# Altium schematic sheet PCB_PDB.SchDoc
size A3; SheetNumber: 1; SheetTotal: 1
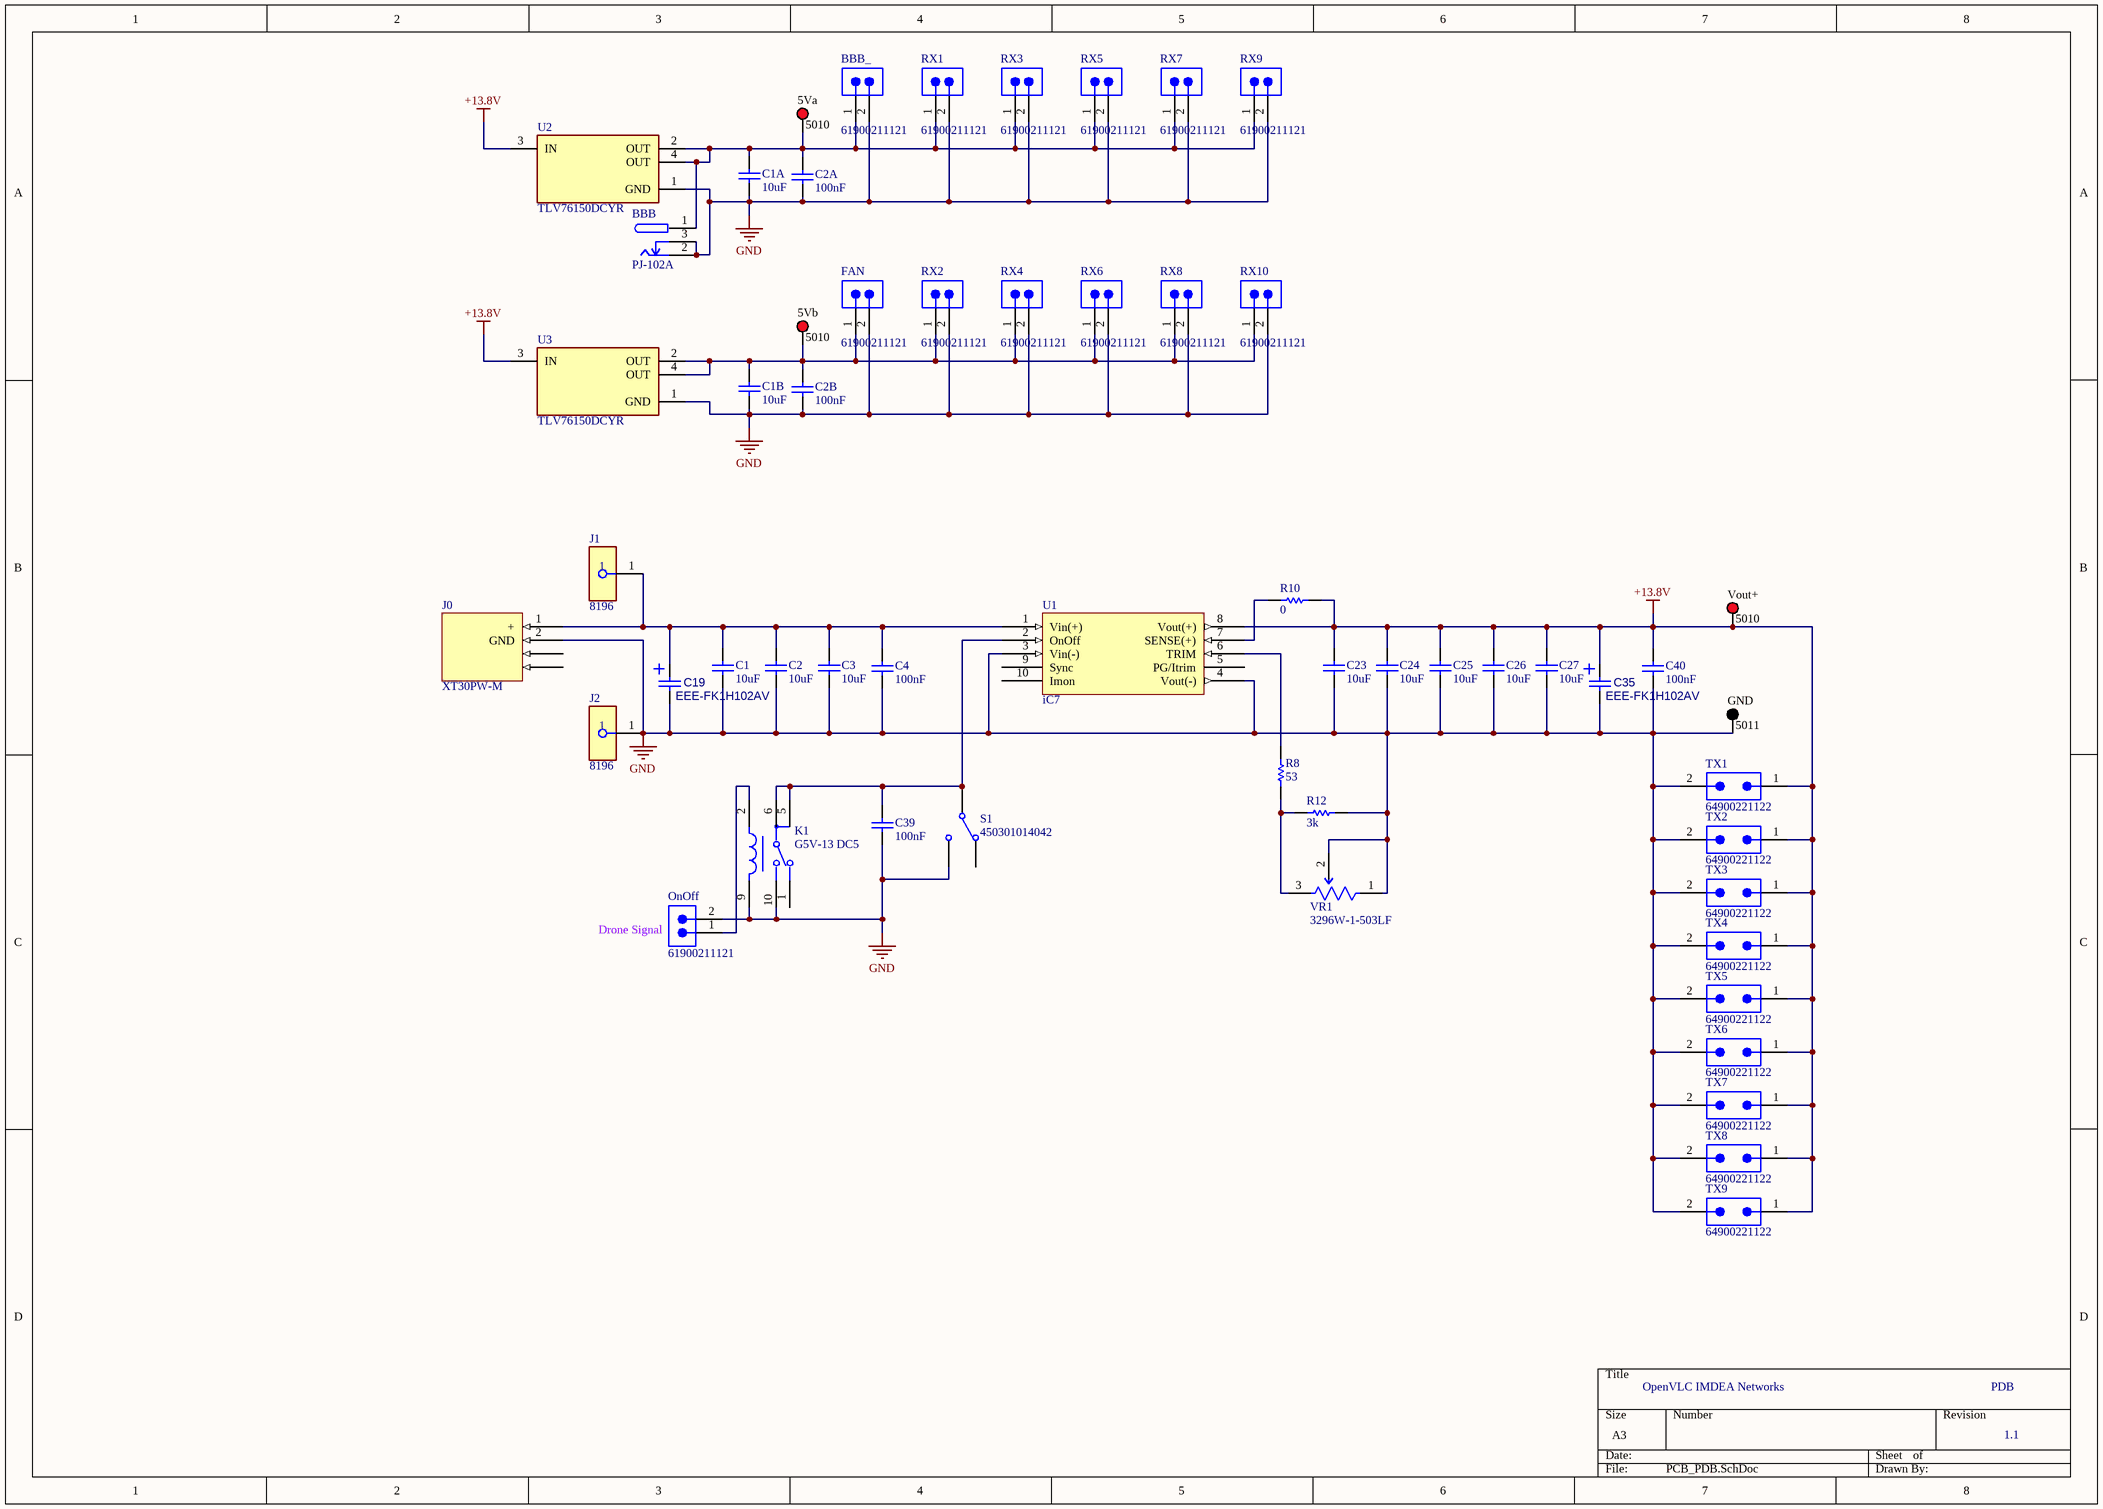
[diagram p0: PCB_PDB.SchDoc]

## Parts
5Va  5010  [KSTN-5010_V]
5Vb  5010  [KSTN-5010_V]
BBB  PJ-102A  [FP-PJ-102A-MFG]
BBB_  61900211121  [61900211121]
C1  value 10uF  [RESC1608X55N]  (hidden comment: GRM188R6YA106MA73D)
C1A  value 10uF  [RESC1608X55N]  (hidden comment: GRM188R6YA106MA73D)
C1B  value 10uF  [RESC1608X55N]  (hidden comment: GRM188R6YA106MA73D)
C2  value 10uF  [RESC1608X55N]  (hidden comment: GRM188R6YA106MA73D)
C2A  value 100nF  [RESC1608X55N]  (hidden comment: GCM188R71H104KA57J)
C2B  value 100nF  [RESC1608X55N]  (hidden comment: GCM188R71H104KA57J)
C3  value 10uF  [RESC1608X55N]  (hidden comment: GRM188R6YA106MA73D)
C4  value 100nF  [RESC1608X55N]  (hidden comment: GCM188R71H104KA57J)
C19  EEE-FK1H102AV  [CAP-17x17]
C23  value 10uF  [RESC1608X55N]  (hidden comment: GRM188R6YA106MA73D)
C24  value 10uF  [RESC1608X55N]  (hidden comment: GRM188R6YA106MA73D)
C25  value 10uF  [RESC1608X55N]  (hidden comment: GRM188R6YA106MA73D)
C26  value 10uF  [RESC1608X55N]  (hidden comment: GRM188R6YA106MA73D)
C27  value 10uF  [RESC1608X55N]  (hidden comment: GRM188R6YA106MA73D)
C35  EEE-FK1H102AV  [CAP-17x17]
C39  value 100nF  [RESC1608X55N]  (hidden comment: GCM188R71H104KA57J)
C40  value 100nF  [RESC1608X55N]  (hidden comment: GCM188R71H104KA57J)
FAN  61900211121  [61900211121]
GND  5011  [KSTN-5011_V]
J0  XT30PW-M  [XT30-Footprint-1]
J1  8196  [FP-8196-MFG]
J2  8196  [FP-8196-MFG]
K1  G5V-13 DC5  [FP-G5V-13_DC5-MFG]
OnOff  61900211121  [61900211121]
R8  value 53  [RESC1608X55N]  (hidden comment: RN73R1JTTD53R0B25)
R10  value 0  [RESC1608X55N]  (hidden comment: RMCF0603ZT0R00)
R12  value 3k  [RESC1608X55N]  (hidden comment: RK73H1JTTD2001D)
RX1  61900211121  [61900211121]
RX2  61900211121  [61900211121]
RX3  61900211121  [61900211121]
RX4  61900211121  [61900211121]
RX5  61900211121  [61900211121]
RX6  61900211121  [61900211121]
RX7  61900211121  [61900211121]
RX8  61900211121  [61900211121]
RX9  61900211121  [61900211121]
RX10  61900211121  [61900211121]
S1  450301014042  [450301014042]
TX1  64900221122  [64900221122]
TX2  64900221122  [64900221122]
TX3  64900221122  [64900221122]
TX4  64900221122  [64900221122]
TX5  64900221122  [64900221122]
TX6  64900221122  [64900221122]
TX7  64900221122  [64900221122]
TX8  64900221122  [64900221122]
TX9  64900221122  [64900221122]
U1  iC7  [New footprint 1]
U2  TLV76150DCYR  [FP-DCY0004A-MFG]
U3  TLV76150DCYR  [FP-DCY0004A-MFG]
Vout+  5010  [KSTN-5010_V]
VR1  3296W-1-503LF  [FP-3296W-MFG]

## Nets
+13.8V: C23.2 C24.2 C25.2 C26.2 C27.2 C35.1 C40.2 R10.1 TX1.1 TX2.1 TX3.1 TX4.1 TX5.1 TX6.1 TX7.1 TX8.1 TX9.1 U1.8(Vout(+)) U2.3(IN) U3.3(IN) Vout+.1
GND: BBB.2 BBB.3 BBB_.2 C1.1 C1A.1 C1B.1 C2.1 C2A.2 C2B.2 C3.1 C4.2 C19.2 C23.1 C24.1 C25.1 C26.1 C27.1 C35.2 C39.2 C40.1 FAN.2 GND.1 J0.2(GND) J2.1 K1.9 K1.10 OnOff.2 R12.1 RX1.2 RX2.2 RX3.2 RX4.2 RX5.2 RX6.2 RX7.2 RX8.2 RX9.2 RX10.2 S1.L2 TX1.2 TX2.2 TX3.2 TX4.2 TX5.2 TX6.2 TX7.2 TX8.2 TX9.2 U1.3(Vin(-)) U1.4(Vout(-)) U2.1(GND) U3.1(GND) VR1.1(CCW) VR1.2(WIPER)
Net5Va_1: 5Va.1 BBB.1 BBB_.1 C1A.2 C2A.1 RX1.1 RX3.1 RX5.1 RX7.1 RX9.1 U2.2(OUT) U2.4(OUT)
Net5Vb_1: 5Vb.1 C1B.2 C2B.1 FAN.1 RX2.1 RX4.1 RX6.1 RX8.1 RX10.1 U3.2(OUT) U3.4(OUT)
NetC1_2: C1.2 C2.2 C3.2 C4.1 C19.1 J0.1(+) J1.1 U1.1(Vin(+))
NetC39_1: C39.1 K1.5 K1.6 S1.COM U1.2(OnOff)
NetK1_2: K1.2 OnOff.1
NetR8_1: R8.1 U1.6(TRIM)
NetR8_2: R8.2 R12.2 VR1.3(CW)
NetR10_2: R10.2 U1.7(SENSE(+))

Not connected (* = marked no-connect by the designer): J0 3(NC3) 4(NC4); K1 1; S1 L1; U1 5(PG/Itrim) 9(Sync) 10(Imon)

## Notes on the sheet
- (near OnOff) Drone Signal
- OpenVLC IMDEA Networks
- PDB
- 1.1

## Library data of the parts
5Va 5Vb Vout+ = CMP-1672-00002-4: Test Point, Red, Through Hole, RoHS, Bulk; Manufacturer: Keystone; Contact Material: Bronze; Mounting Technology: Through Hole; RoHSCompliant: true; Pins: 1; Package Quantity: 100; ComponentLink2Description: Datasheet; Height: 8.12 mm; ComponentLink1URL: http://www.keyelco.com/; DatasheetVersion: Rev. F, 12/2013; Mount: Through Hole; PackageReference: 5010; Contact Plating: Silver; Packaging: Bulk; Colour: Red; REACH SVHC: No SVHC; PackageDescription: 1-Pin Through Hole Device, Dia 3.17 mm; ComponentLink2URL: http://www.keyelco.com/product-pdf.cfm?p=1319; ComponentLink1Description: Manufacturer URL
BBB = CMP-12637-106234071-1: PJ-102A 2.0 x 6.5 mm, 2.5 A, Horizontal, Through Hole, Tapered Pins, Dc Power Jack Connector; Voltage Rating (DC): 24V; Number of Contacts: 3; Outside Diameter: 6.5mm; Gender: Male; Shielding: No; Insulation Resistance: 50MΩ; Current Rating: 2.5A; Inside Diameter: 2mm; Number of Conductors: 2; Housing Color: Black; RoHS: Compliant; Diameter: 2.1mm; Mount: Through Hole; Contact Plating: Nickel; NexarPartId: 106234071; Voltage Rating: 24V; Housing Material: Thermoplastic; Max Operating Temperature: 85°C; Color: Black; Contact Material: Copper, Nickel, Tin; Orientation: Horizontal; Packaging: Bulk; Flammability Rating: UL94 V-0; Schedule B: 8536695050, 8536695050; Contact Gender: Male; Lead Free: Lead Free; Termination: Through Hole; Min Operating Temperature: -25°C; Height: 11.2mm; Lifecycle Status: Production
BBB_ FAN OnOff RX1-RX10 = CMP-1502-00584-3: NexarPartId: 18818218; Gender: Male; Connector Type: Male Pin; Insulation Resistance: 1GΩ; Contact Resistance: 20mΩ; Number of Contacts: 2; Operating Supply Voltage: 250V; Current Rating: 3A; Pitch: 2.54mm; Color: Beige; Fastening Type: Friction; Number of Pins: 2; Lead Pitch: 2.54mm; Orientation: Vertical; Max Operating Temperature: 105°C; Contact Mating Length: 7.493mm; RoHS: Compliant; Voltage Rating: 250V; Number of Positions: 2; Mount: Through Hole; Length: 5.08mm; Contact Plating: Tin; Width: 5.12mm; Termination: Through Hole; Flammability Rating: UL94 V-0; Min Operating Temperature: -40°C; Housing Material: Nylon; Contact Gender: Male; Number of Rows: 1; Packaging: Bulk; REACH SVHC: Unknown; Contact Material: Copper; Height: 11.75mm
C1 C1A C1B C2 C2A C2B C3 C4 C23-C27 C39 C40 = Cap: Capacitor; Published: 8-Jun-2000; LatestRevisionDate: 17-Jul-2002; LatestRevisionNote: Re-released for DXP Platform.; PackageReference: RAD-0.3; Publisher: Altium Limited; PackageDescription: Radial Cap, Thru-Hole; 2 Leads; 0.3 in Pin Spacing
C19 C35 = CMP-001-00083-1: CAP-17x17
GND = CMP-1672-00003-4: Test Point, Black, Through Hole, RoHS, Bulk; Manufacturer: Keystone; ComponentLink2URL: http://www.keyelco.com/product-pdf.cfm?p=1320; Colour: Black; Pins: 1; REACH SVHC: No SVHC; ComponentLink1URL: http://www.keyelco.com/; PackageReference: 5011; Contact Plating: Silver; Package Quantity: 100; Packaging: Bulk; RoHSCompliant: true; Height: 8.12 mm; PackageDescription: 1-Pin Through Hole Device, Dia 3.17 mm; Mount: Through Hole; Mounting Technology: Through Hole; DatasheetVersion: Rev. F, 12/2013; ComponentLink1Description: Manufacturer URL; Contact Material: Bronze; ComponentLink2Description: Datasheet
J0 = CMP-00002-1
J1 J2 = CMP-00214-00036902-2: 8196 PC Screw Terminal 0.67 in. L Brass Tin Plate Stainless Steel Mounting Hole 0.045 in. T; NexarPartId: 36902; Wire Gauge (Min): 22AWG; Connector Type: PCB, Terminal Block; Gender: Female; Number of Ports: 1; Current Rating: 30A; Wire Gauge (Max): 12AWG; Insulation: Non-Insulated; Number of Contacts: 6; Number of Rows: 2; Contact Material: Brass; REACH SVHC: No SVHC; Packaging: Bulk; Length: 11.93mm; Material: Brass; Terminal Material: Brass; Mount: Snap in, Through Hole; Height: 11.7602mm; Number of Terminals: 6; Orientation: Straight; Max Current Rating: 30A; Contact Plating: Tin; Termination: Screw; RoHS: Compliant; Lead Free: Lead Free; Depth: 11.93mm; Number of Pins: 6
K1 = CMP-08823-000054-1: RELAY GEN PURPOSE SPDT 1A 5VDC; Release Time: 5ms; Coil Voltage (DC): 5V; Coil Current: 30mA; Coil Type: Non-Latching; Relay Type: General Purpose; Power Consumption: 150mW; Coil Resistance: 167R; Mount: Through Hole; Max Operating Temperature: 70°C; Package Quantity: 25; Contact Material: Gold; Series: G5V-1; Throw Configuration: SPDT; Operate Time: 5ms; Packaging: Rail/Tube; Termination: PC Pin; Coil Power: 150mW; Contact Current Rating: 1A; Min Operating Temperature: -40°C
R8 R10 R12 = Res1: Resistor; Published: 8-Jun-2000; LatestRevisionDate: 17-Jul-2002; LatestRevisionNote: Re-released for DXP Platform.; PackageReference: AXIAL-0.3; Publisher: Altium Limited; PackageDescription: Axial Device, Thru-Hole; 2 Leads; 0.3 in Pin Spacing
S1 = CMP-1466-00001-2: NexarPartId: 23825802; Mechanical Life: 2kcycles; Actuator Length: 1.4mm; Contact Resistance: 30mΩ; Voltage Rating (DC): 12V; Contact Current Rating: 500mA; Actuator Material: Nylon, Polyamide; Switch Function: On-On; Switch Travel: 1.6mm; Insulation Resistance: 10GΩ; Packaging: Bulk; Height: 5.9mm; Lead Free: Lead Free; Width: 2.5mm; Current Rating: 500mA; Termination: PC Pin; Mount: Through Hole; Orientation: Vertical; REACH SVHC: No SVHC; Voltage Rating: 12V; Contact Material: Gold; Max Operating Temperature: 85°C; Min Operating Temperature: -40°C; Electrical Life: 2kcycles; RoHS: Compliant; Length: 8.42mm; Color: Grey; Life (Cycles): 2kcycles; Contact Plating: Gold; Throw Configuration: SPDT
TX1-TX9 = CMP-1502-00493-2: NexarPartId: 8917578; Contact Resistance: 10mΩ; Operating Supply Voltage: 600V; Current Rating: 9A; Gender: Male; Number of Contacts: 2; Lead Length: 3.5mm; Connector Type: Male Pin, Socket; Pitch: 4.2mm; Row Spacing: 5.5118mm; Insulation Resistance: 1GΩ; Height: 12.8mm; Max Operating Temperature: 105°C; Color: White; Number of Rows: 2; Voltage Rating: 600V; Termination: Solder; Fastening Type: Ramp; Width: 5.5mm; Min Operating Temperature: -40°C; Length: 5.4mm; Mount: Through Hole; Flammability Rating: UL94 V-0; Contact Gender: Male; Contact Material: Copper; Lead Pitch: 4.2mm; Housing Material: Nylon; Contact Plating: Tin; Number of Pins: 2; RoHS: Compliant; Orientation: Vertical; REACH SVHC: Unknown; Number of Positions: 2
U1 = CMP-00000-3: DC-DC Converters, PCB mount type, Output: 300W, wide range (8 to 24V), Non-Isolated Step-up/Step-down
U2 U3 = CMP-00370-134324849-1: TLV76150DCYR 1-A 16-V high-PSRR linear voltage regulator 4-SOT-223 -40 to 125; Manufacturer Lifecycle Status: ACTIVE; Number of Channels: 1; Min Supply Voltage: 6.5V; Nominal Supply Current: 65µA; Dropout Voltage: 900mV; Accuracy: 1%; Max Supply Voltage: 16V; Max Junction Temperature (Tj): 125°C; Output Current: 1A; Output Voltage: 5V; Width: 3.5mm; Length: 6.5mm; NexarPartId: 134324849; Max Operating Temperature: 125°C; Thickness: 1.6mm; Min Operating Temperature: -40°C; Case/Package: SOT-223; Height: 1.8mm; Lifecycle Status: Production; Number of Pins: 4; Number of Outputs: 1
VR1 = CMP-07234-000043-1: TRIMMER 50K OHM 0.5W PC PIN TOP; Manufacturer Series: 3296; Resistance Tolerance: 10%; Actuator Orientation: Vertical; Resistance: 50kR; Number of Turns: 25; Power Rating: 500mW; Insulation Resistance: 1GR; Actuator Type: SCREW; Resistance Law: Linear; Number of Terminals/Pins: 3; Temperature Coefficient: 100ppm/°C; Weight: 0.03oz; Length: 9.53mm; Package Quantity: 50; Resistor Type: Cermet; Min Operating Temperature: -55°C; Termination: Pin; Radiation Hardening: No; Terminal Finish: Tin; Height: 0.395inch; Depth: 4.83mm; REACH SVHC: No SVHC; Width: 9.53mm; Packaging: Rail/Tube; RoHS Compliant: Yes; Mount: Panel; Max Power Dissipation: 500mW; Taper: Linear; Color: Blue; Technology: CERMET; Lead Free: Lead Free; Max Operating Temperature: 125°C; Number of Pins: 3; Type: Potentiometer; Military Standard: Not; Contact Plating: Tin; Series: 3296; Tolerance: 10%